# Altium schematic sheet [01] - COVER PAGE.SchDoc
size A3; DocumentNumber: 1; SheetNumber: 1; SheetTotal: 6
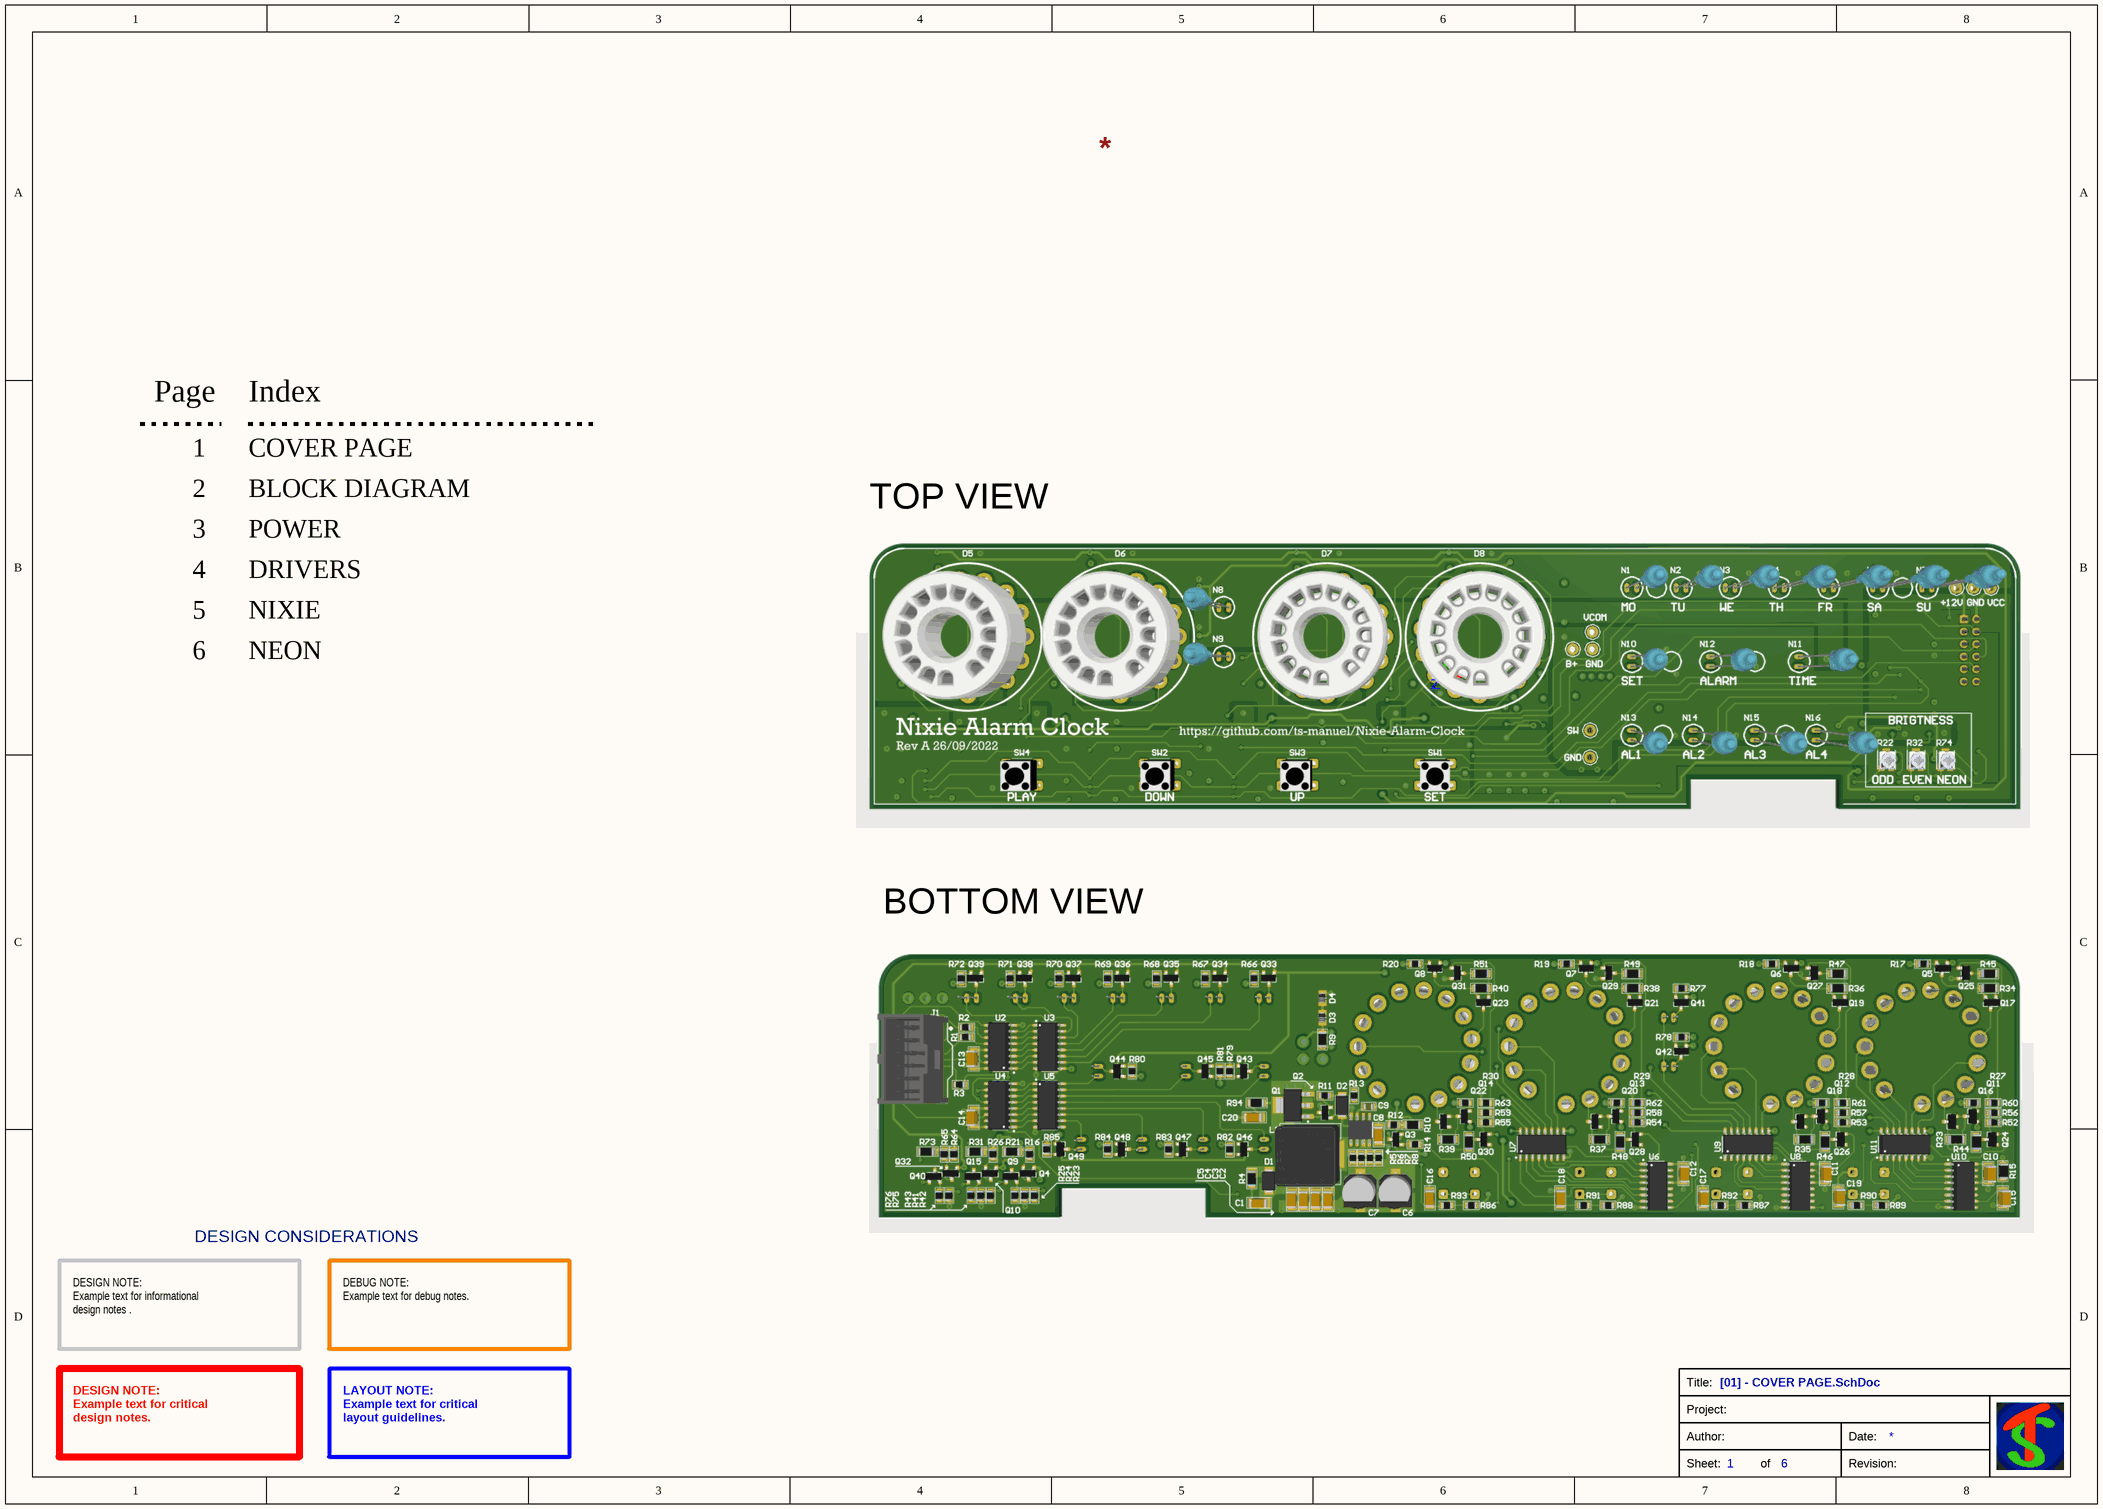
[diagram p0: [01] - COVER PAGE.SchDoc]

## Notes on the sheet
- Page
- Index
- 1
- 2
- COVER PAGE
- BLOCK DIAGRAM
- TOP VIEW
- 3
- 4
- POWER
- DRIVERS
- 5
- NIXIE
- 6
- NEON
- BOTTOM VIEW
- DESIGN CONSIDERATIONS
- DESIGN NOTE:
  Example text for informational
  design notes .
- DEBUG NOTE:
  Example text for debug notes.
- DESIGN NOTE:
  Example text for critical
  design notes.
- LAYOUT NOTE:
  Example text for critical
  layout guidelines.
- Title:
- Project:
- Sheet:
- Author:
- of
- Revision:
- Date: